# Altium project MiniPC.PrjPcb (part 16 of 17)

## Sheet 3V3_to_1V8.SchDoc: 3.3V to 1.8V Converter
size B; DocumentNumber: 45; SheetNumber: 45; SheetTotal: 46
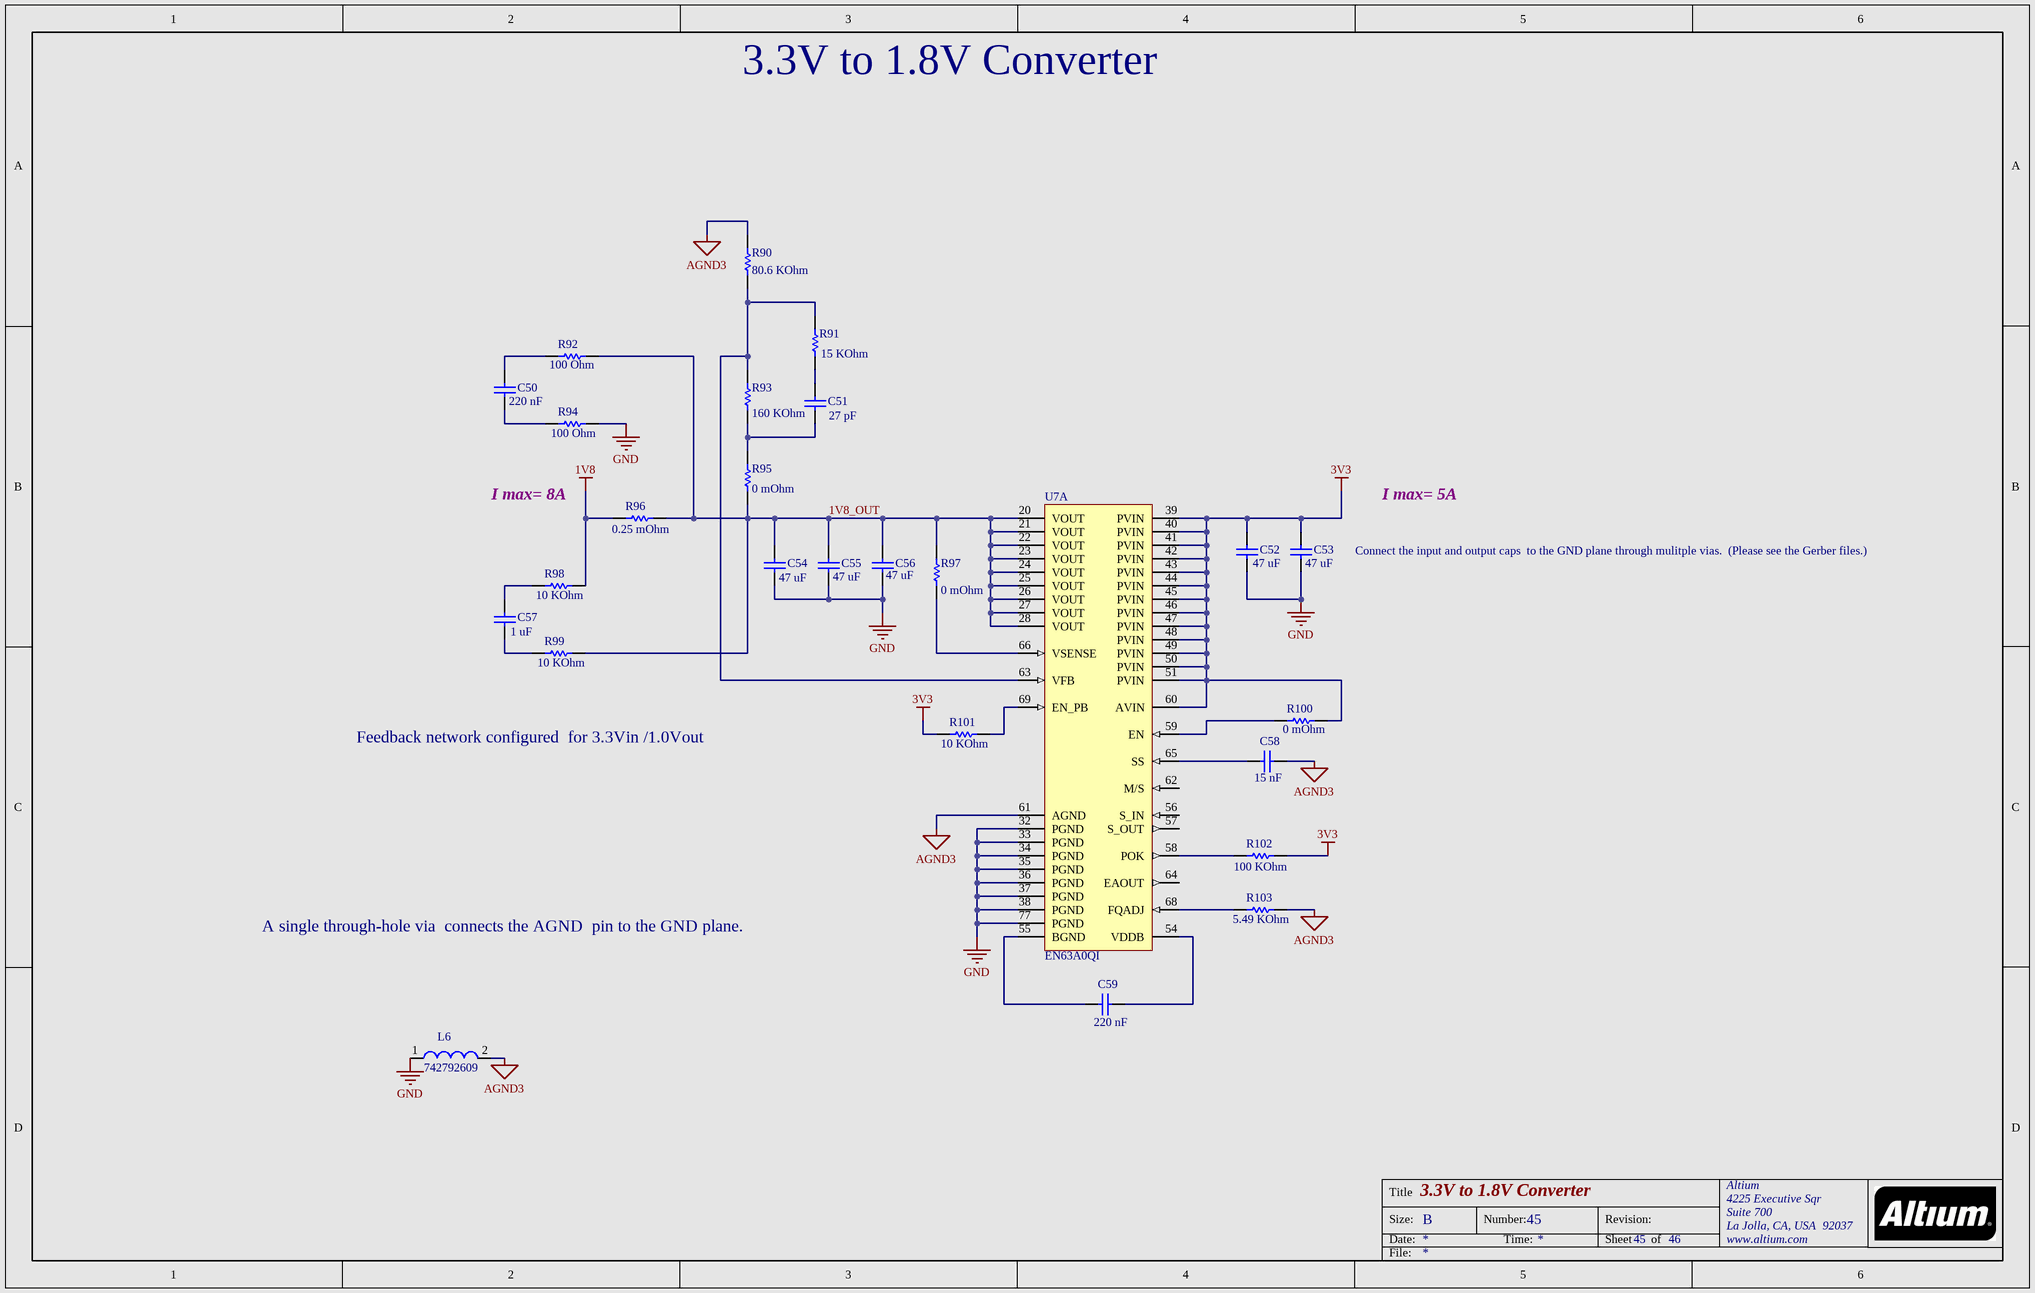
[diagram p48: 3V3_to_1V8.SchDoc]

### Parts
C50  Capacitance: 220 nF  [CAPC1005X55X25NL05T10]  (hidden comment: GRM155R61A224KE19D)
C51  Capacitance: 27 pF  [CAPC1005X55X20ML5T10]  (hidden comment: ECJ-0EC1H270J)
C52  Capacitance: 47 uF  [CAPC3216X180X20ML20]  (hidden comment: C3216X5R1A476M160AB)
C53  Capacitance: 47 uF  [CAPC3216X180X20ML20]  (hidden comment: C3216X5R1A476M160AB)
C54  Capacitance: 47 uF  [CAPC3216X180X20ML20]  (hidden comment: C3216X5R1A476M160AB)
C55  Capacitance: 47 uF  [CAPC3216X180X20ML20]  (hidden comment: C3216X5R1A476M160AB)
C56  Capacitance: 47 uF  [CAPC3216X180X20ML20]  (hidden comment: C3216X5R1A476M160AB)
C57  Capacitance: 1 uF  [CAPC1005X33X10LL5]  (hidden comment: CGB2A1X5R1E105K033BC)
C58  Capacitance: 15 nF  [CAPC1005X55X23ML05T8]  (hidden comment: VJ0402Y153JXQPW1BC)
C59  Capacitance: 220 nF  [CAPC1005X55X25NL05T10]  (hidden comment: GRM155R61A224KE19D)
L6  742792609  [SMD-0603]
R90  Resistance: 80.6 KOhm  [RESC1005X40X25ML05T05]  (hidden comment: ERJ-2RKF8062X)
R91  Resistance: 15 KOhm  [RESC1005X40X25ML05T05]  (hidden comment: ERJ-2RKF1502X)
R92  Resistance: 100 Ohm  [RESC1005X40X25LL05T05]  (hidden comment: ERJ-2RKF1000X)
R93  Resistance: 160 KOhm  [RESC1005X40X25ML05T05]  (hidden comment: CRCW0402160KFKED)
R94  Resistance: 100 Ohm  [RESC1005X40X25LL05T05]  (hidden comment: ERJ-2RKF1000X)
R95  Resistance: 0 mOhm  [RESC1005X40X25ML05T05]  (hidden comment: ERJ-2GE0R00X)
R96  Resistance: 0.25 mOhm  [STAC-CSS2725-099H_V]  (hidden comment: CSS2725FTL250)
R97  Resistance: 0 mOhm  [RESC1005X40X25ML05T05]  (hidden comment: ERJ-2GE0R00X)
R98  Resistance: 10 KOhm  [RESC1005X40X25NL05T05]  (hidden comment: ERJ-2RKF1002X)
R99  Resistance: 10 KOhm  [RESC1005X40X25NL05T05]  (hidden comment: ERJ-2RKF1002X)
R100  Resistance: 0 mOhm  [RESC1005X40X25ML05T05]  (hidden comment: ERJ-2GE0R00X)
R101  Resistance: 10 KOhm  [RESC1005X40X25NL05T05]  (hidden comment: ERJ-2RKF1002X)
R102  Resistance: 100 KOhm  [RESC1005X40X25LL05T05]  (hidden comment: ERJ-2RKF1003X)
R103  Resistance: 5.49 KOhm  [RESC1005X40X25NL05T05]  (hidden comment: ERJ-2RKF5491X)
U7  EN63A0QI  [ALTR-QFN-76_A-305_V]  (part A of 2)

### Nets
1V8: R96.1 R98.2
3V3: C52.2 C53.2 R100.1 R101.1 R102.2 U7.39(PVIN) U7.40(PVIN) U7.41(PVIN) U7.42(PVIN) U7.43(PVIN) U7.44(PVIN) U7.45(PVIN) U7.46(PVIN) U7.47(PVIN) U7.48(PVIN) U7.49(PVIN) U7.50(PVIN) U7.51(PVIN) U7.60(AVIN)
AGND3: C58.1 L6.2 R90.2 R103.2 U7.61(AGND)
GND: C52.1 C53.1 C54.1 C55.1 C56.1 L6.1 R94.1 U7.32(PGND) U7.33(PGND) U7.34(PGND) U7.35(PGND) U7.36(PGND) U7.37(PGND) U7.38(PGND) U7.77(PGND)
1V8_OUT: C54.2 C55.2 C56.2 R92.1 R95.1 R96.2 R97.2 R99.2 U7.20(VOUT) U7.21(VOUT) U7.22(VOUT) U7.23(VOUT) U7.24(VOUT) U7.25(VOUT) U7.26(VOUT) U7.27(VOUT) U7.28(VOUT)
NetC50_1: C50.1 R92.2
NetC50_2: C50.2 R94.2
NetC51_1: C51.1 R93.1 R95.2
NetC51_2: C51.2 R91.1
NetC57_1: C57.1 R99.1
NetC57_2: C57.2 R98.1
NetC58_2: C58.2 U7.65(SS)
NetC59_1: C59.1 U7.55(BGND)
NetC59_2: C59.2 U7.54(VDDB)
NetR90_1: R90.1 R91.2 R93.2 U7.63(VFB)
NetR97_1: R97.1 U7.66(VSENSE)
NetR100_2: R100.2 U7.59(EN)
NetR101_2: R101.2 U7.69(EN_PB)
NetR102_1: R102.1 U7.58(POK)
NetR103_1: R103.1 U7.68(FQADJ)

Not connected (* = marked no-connect by the designer): U7 56(S_IN) 57(S_OUT) 62(M/S) 64(EAOUT)

### Notes on the sheet
- I max= 8A
- I max= 5A
- Connect the input and output caps  to the GND plane through mulitple vias.  (Please see the Gerber files.)
- Feedback network configured  for 3.3Vin /1.0Vout
- A single through-hole via  connects the AGND  pin to the GND plane.
- Title
- Size:
- Date:
- B
- Number:
- Time:
- Revision:
- Sheet
- of
- File:

### Library data of the parts
C50 C59 = CMP-2008-04561-4: as C115 on sheet 12V_to_5V; ComponentLink1URL: http://www.murata.com/; Package Quantity: 1; Tolerance: 10%; Mounting Technology: Surface Mount; RoHSCompliant: true; PartNumber: GRM155R61A224KE19D; Max Operating Temperature: 85 degC; Case Code (Imperial): 0402; Length: 1 mm; Packaging: Tape and Reel; Min Operating Temperature: -55 degC; PackageDescription: 2-Pin Surface Mount Device, Body 1 x 0.5 mm; Height: 0.5 mm; Case Code (Metric): 1005; REACH SVHC: No SVHC; ComponentLink1Description: Manufacturer URL; Width: 0.5 mm; ComponentLink2URL: http://search.murata.co.jp/Ceramy/image/img/A01X/G101/ENG/GRM155R61A224KE19-01.pdf; Radiation Hardening: No; Pins: 2; Voltage Rating (DC): 10 V; DatasheetVersion: 03/2016; Mount: Surface Mount; PackageReference: 0402; ComponentLink2Description: Datasheet
C51 = CMP-1665-00021-1: as C17 on sheet 3.3V_to_1.0V; Tolerance: 5%; Min Operating Temperature: -55 degC; Max Operating Temperature: 125 degC; DatasheetVersion: 09/2008; Width: 0.02 inch; Packaging: Tape and Reel; RoHSCompliant: true; ComponentLink2URL: http://media.digikey.com/pdf/Data%20Sheets/Panasonic%20Capacitors%20PDFs/ECJ_(General).pdf; Mount: Surface Mount; ComponentLink1URL: http://www.panasonic.com/; PackageDescription: 2-Pin Surface Mount Device, Body 1 x 0.5 mm; Length: 0.039 inch; Case Code (Metric): 1005; Package Quantity: 10000; ComponentLink2Description: Datasheet; PackageReference: 0402; Height: 0.5 mm; Case Code (Imperial): 0402; Mounting Technology: Surface Mount; ComponentLink1Description: Manufacturer URL
C52-C56 = CMP-1663-00005-1: as C112 on sheet 12V_to_5V; Tolerance: 20%; Voltage Rating: 10 V; Packaging: Tape and Reel; ComponentLink2URL: https://product.tdk.com/info/en/catalog/datasheets/mlcc_commercial_general_en.pdf; Min Operating Temperature: -55 degC; Length: 3.2 mm; Radiation Hardening: No; Mounting Technology: Surface Mount; PackageDescription: 2-Pin Surface Mount Device, Body 3.2 x 1.6 mm; Max Operating Temperature: 85 degC; Case Code (Metric): 3216; ComponentLink1URL: http://www.tdk.com/; DatasheetVersion: 03/2015; Mount: Surface Mount; Case Code (Imperial): 1206; Package Quantity: 2000; ComponentLink2Description: Datasheet; PackageReference: 3216; Height: 1.6 mm; RoHSCompliant: true; Width: 1.6 mm; ComponentLink1Description: Manufacturer URL
C57 = CMP-1663-00006-2: as C109 on sheet 12V_to_5V; Tolerance: 10%; PackageDescription: 2-Pin Surface Mount Device, Body 1 x 0.5 mm; PartNumber: CGB2A1X5R1E105K033BC; Case Code (Metric): 1005; DatasheetVersion: 04/2015; RoHSCompliant: True; Max Operating Temperature: 85 degC; ComponentLink2URL: https://product.tdk.com/info/en/catalog/datasheets/mlcc_commercial_lowprofile_en.pdf; Package Quantity: 1; Width: 0.02 inch; Case/Package: 0402; Case Code (Imperial): 0402; Packaging: Tape and Reel; Length: 0.039 inch; Min Operating Temperature: -55 degC; Mounting Technology: Surface Mount; ComponentLink2Description: Datasheet; ComponentLink1URL: http://www.tdk.com/; ComponentLink1Description: Manufacturer URL
C58 = CMP-1666-00015-3: as C14 on sheet 3.3V_to_0.9V; DatasheetVersion: 07/2016; ComponentLink1Description: Manufacturer URL; ComponentLink1URL: http://www.vishay.com/; PackageDescription: 2-Pin Surface Mount Device, Body 1 x 0.5 mm; ComponentLink2URL: http://www.vishay.com/docs/28548/vjw1bcbascomseries.pdf; ComponentLink2Description: Datasheet; Mounting Technology: Surface Mount; Length: 1 mm; PartNumber: VJ0402Y153JXQPW1BC; RoHSCompliant: true; Package Quantity: 50000; Min Operating Temperature: -55 degC; Case Code (Metric): 1005; Max Operating Temperature: 125 degC; Width: 0.5 mm; Tolerance: 5%; Packaging: Tape and Reel; Case Code (Imperial): 0402; Height: 0.5 mm; PackageReference: 0402; Mount: Surface Mount; Pins: 2; Voltage Rating: 10 V
L6 = CMP-0220-00193-1: as L10 on sheet 12V_to_5V; ComponentLink2URL: http://www.we-online.de/katalog/media/pdf/742792609.pdf; ComponentLink1URL: http://www.we-online.com; ComponentLink2Description: Datasheet; PackageDescription: Chip Inductor, 2-Leads, Body 1.6 x 0.8 mm; ComponentLink1Description: Manufacturer Link; PackageReference: SMD-0603; DatasheetVersion: Dec-2005; PackageVersion: 2009
R90 = CMP-2002-01074-3: as R174 on sheet 12V_to_5V; REACH SVHC: No SVHC; Min Operating Temperature: -55 degC; Max Operating Temperature: 155 degC; ComponentLink1Description: Manufacturer URL; PackageDescription: 2-Pin Surface Mount Device, Body 1 x 0.5 mm; ComponentLink1URL: http://www.panasonic.com/; PartNumber: ERJ-2RKF8062X; Case Code (Metric): 1005; Packaging: Tape and Reel; Mount: Surface Mount; Tolerance: 1%; Package Quantity: 1; RoHSCompliant: true; Mounting Technology: Surface Mount; Height: 0.35 mm; Width: 0.5 mm; Case Code (Imperial): 0402; Length: 1 mm; ComponentLink2Description: Datasheet; Pins: 2; DatasheetVersion: 04/2015; ComponentLink2URL: http://industrial.panasonic.com/cdbs/www-data/pdf/RDA0000/AOA0000C86.pdf; PackageReference: 0402
R91 = CMP-2002-00694-3: as R22 on sheet 3.3V_to_0.9V; Max Operating Temperature: 155 degC; Case Code (Imperial): 0402; Case Code (Metric): 1005; PartNumber: ERJ-2RKF1502X; Package Quantity: 10000; REACH SVHC: Yes; Width: 0.5 mm; Mount: Surface Mount; Mounting Technology: Surface Mount; Packaging: Tape and Reel; Tolerance: 1%; ComponentLink1Description: Manufacturer URL; ComponentLink1URL: http://www.panasonic.com/; Height: 0.35 mm; Length: 1 mm; PackageDescription: 2-Pin Surface Mount Device, Body 1 x 0.5 mm; Min Operating Temperature: -55 degC; RoHSCompliant: true; Pins: 2; PackageReference: 0402; DatasheetVersion: 04/2015; ComponentLink2URL: http://industrial.panasonic.com/cdbs/www-data/pdf/RDA0000/AOA0000C86.pdf; Weight: 2.8E-05oz; Radiation Hardening: No; ComponentLink2Description: Datasheet
R92 R94 = CMP-2002-00605-3: as R28 on sheet 3.3V_to_0.9V; ComponentLink1URL: http://www.panasonic.com/; Package Quantity: 10000; Packaging: Tape and Reel; PackageDescription: 2-Pin Surface Mount Device, Body 1 x 0.5 mm; Tolerance: 1%; ComponentLink1Description: Manufacturer URL; REACH SVHC: Yes; Case Code (Imperial): 0402; Mounting Technology: Surface Mount; Min Operating Temperature: -55 degC; RoHSCompliant: true; Length: 1 mm; Width: 0.5 mm; Height: 0.35 mm; Max Operating Temperature: 155 degC; PartNumber: ERJ-2RKF1000X; Mount: Surface Mount; Case Code (Metric): 1005; Pins: 2; ComponentLink2Description: Datasheet; PackageReference: 0402; DatasheetVersion: 04/2015; Radiation Hardening: No; ComponentLink2URL: http://industrial.panasonic.com/cdbs/www-data/pdf/RDA0000/AOA0000C86.pdf
R93 = CMP-2002-08227-3: as R24 on sheet 3.3V_to_0.9V; Tolerance: 1%; Min Operating Temperature: -55 degC; Length: 1 mm; Height: 0.35 mm; Package Quantity: 10; Mounting Technology: Surface Mount; Mount: Surface Mount; Max Operating Temperature: 155 degC; PartNumber: CRCW0402160KFKED; Case Code (Imperial): 0402; Packaging: Tape and Reel; ComponentLink1Description: Manufacturer URL; Case Code (Metric): 1005; ComponentLink1URL: http://www.vishay.com/; RoHSCompliant: true; REACH SVHC: Unknown; PackageDescription: 2-Pin Surface Mount Device, Body 1 x 0.5 mm; Width: 0.5 mm; ComponentLink2Description: Datasheet; Pins: 2; PackageReference: 0402; Weight: 2.3E-05oz; ComponentLink2URL: http://www.vishay.com/docs/20035/dcrcwe3.pdf; Radiation Hardening: No; DatasheetVersion: 06/2012
R95 R97 R100 = CMP-2002-00429-3: as R173 on sheet 12V_to_5V; Max Operating Temperature: 155 degC; Tolerance: 5%; PartNumber: ERJ-2GE0R00X; Case Code (Imperial): 0402; Package Quantity: 10000; Length: 1 mm; Mounting Technology: Surface Mount; ComponentLink1URL: http://www.panasonic.com/; Height: 0.35 mm; Width: 0.5 mm; Min Operating Temperature: -55 degC; Case Code (Metric): 1005; RoHSCompliant: true; REACH SVHC: Unknown; ComponentLink1Description: Manufacturer URL; Packaging: Tape and Reel; Mount: Surface Mount; PackageDescription: 2-Pin Surface Mount Device, Body 1 x 0.5 mm; PackageReference: 0402; ComponentLink2URL: http://industrial.panasonic.com/cdbs/www-data/pdf/RDA0000/AOA0000C84.pdf; DatasheetVersion: 03/2015; Radiation Hardening: No; Pins: 2; ComponentLink2Description: Datasheet
R96 = CMP-1719-00001-2: as R42 on sheet 3.3V_to_1.0V; RoHSCompliant: True; ComponentLink2URL: https://www.seielect.com/catalog/SEI-CSS_CSSH.PDF; DatasheetVersion: 06/2016; Radiation Hardening: No; Packaging: Tape and Reel; Package Quantity: 1000; Max Operating Temperature: 225 degC; PackageDescription: 2-Pin Surface Mount Device, Body 6.81 x 6.45 mm; PartNumber: CSS2725FTL250; Length: 0.268 inch; Height: 0.049 inch; ComponentLink1Description: Manufacturer URL; Mounting Technology: Surface Mount; Width: 0.254 inch; ComponentLink2Description: Datasheet; ComponentLink1URL: https://www.seielect.com/; Min Operating Temperature: -55 degC; Tolerance: 1%
R98 R99 R101 = CMP-2002-00607-3: as R175 on sheet 12V_to_5V; Case Code (Imperial): 0402; Min Operating Temperature: -55 degC; PartNumber: ERJ-2RKF1002X; Mounting Technology: Surface Mount; Length: 1 mm; Packaging: Tape and Reel; ComponentLink1Description: Manufacturer URL; Mount: Surface Mount; Package Quantity: 10000; Max Operating Temperature: 155 degC; Case Code (Metric): 1005; Height: 0.35 mm; ComponentLink1URL: http://www.panasonic.com/; Tolerance: 1%; REACH SVHC: Yes; RoHSCompliant: true; Width: 0.5 mm; PackageDescription: 2-Pin Surface Mount Device, Body 1 x 0.5 mm; Radiation Hardening: No; PackageReference: 0402; ComponentLink2Description: Datasheet; DatasheetVersion: 04/2015; ComponentLink2URL: http://industrial.panasonic.com/cdbs/www-data/pdf/RDA0000/AOA0000C86.pdf; Pins: 2
R102 = CMP-2002-00608-3: as R176 on sheet 12V_to_5V; Height: 0.35 mm; ComponentLink1Description: Manufacturer URL; Packaging: Tape and Reel; Min Operating Temperature: -55 degC; RoHSCompliant: true; PackageDescription: 2-Pin Surface Mount Device, Body 1 x 0.5 mm; Mount: Surface Mount; Package Quantity: 10000; Max Operating Temperature: 155 degC; ComponentLink1URL: http://www.panasonic.com/; Tolerance: 1%; Mounting Technology: Surface Mount; PartNumber: ERJ-2RKF1003X; Case Code (Metric): 1005; Case Code (Imperial): 0402; REACH SVHC: Yes; Length: 1 mm; Width: 0.5 mm; DatasheetVersion: 04/2015; Pins: 2; ComponentLink2Description: Datasheet; ComponentLink2URL: http://industrial.panasonic.com/cdbs/www-data/pdf/RDA0000/AOA0000C86.pdf; PackageReference: 0402; Radiation Hardening: No
R103 = CMP-2002-00990-3: as R62 on sheet 3.3V_to_DDR4_VDD; Tolerance: 1%; Packaging: Tape and Reel; RoHSCompliant: true; Length: 0.039 inch; PackageDescription: 2-Pin Surface Mount Device, Body 1 x 0.5 mm; Height: 0.016 inch; Case Code (Imperial): 0402; Min Operating Temperature: -55 degC; PartNumber: ERJ-2RKF5491X; Case Code (Metric): 1005; ComponentLink1Description: Manufacturer URL; Width: 0.02 inch; Package Quantity: 10000; ComponentLink1URL: http://www.panasonic.com/; Mount: Surface Mount; Mounting Technology: Surface Mount; REACH SVHC: Yes; Max Operating Temperature: 155 degC; ComponentLink2URL: http://industrial.panasonic.com/cdbs/www-data/pdf/RDA0000/AOA0000C86.pdf; Pins: 2; ComponentLink2Description: Datasheet; PackageReference: 0402; DatasheetVersion: 04/2015
U7 = CMP-1689-00005-3: as U3 on sheet 3.3V_to_1.0V; PartNumber: EN63A0QI; PackageVersion: Rev. A, 10/2014; ComponentLink3Description: Package Specification; ComponentLink3URL: http://wl.altera.com/literature/ds/EN63A0QA_10398.pdf; PackageDescription: 76-Pin Quad-Flat No-Leads Package, Body 11 x 10 mm, Pitch 0.5 mm, Thermal Pad 2.6x8.1mm; ComponentLink1URL: https://www.altera.com/; DatasheetVersion: Rev. H; Mounting Technology: Surface Mount; ComponentLink2Description: Datasheet; ComponentLink1Description: Manufacturer URL; ComponentLink2URL: https://www.altera.com/content/dam/altera-www/global/en_US/pdfs/literature/ds/en63a0qi_07077.pdf; Pins: 76; Min Operating Temperature: -40 degC; Length: 0.43 inch; Radiation Hardening: No; Max Operating Temperature: 85 degC; Package Quantity: 250; Width: 0.39 inch; Mount: Surface Mount; Packaging: Tape and Reel; Height: 0.12 inch; RoHSCompliant: True

## Sheet 2.5V_and_1.8V_Switches.SchDoc: 2.5V and 1.8V IO Switches
size B; DocumentNumber: 38; SheetNumber: 38; SheetTotal: 46
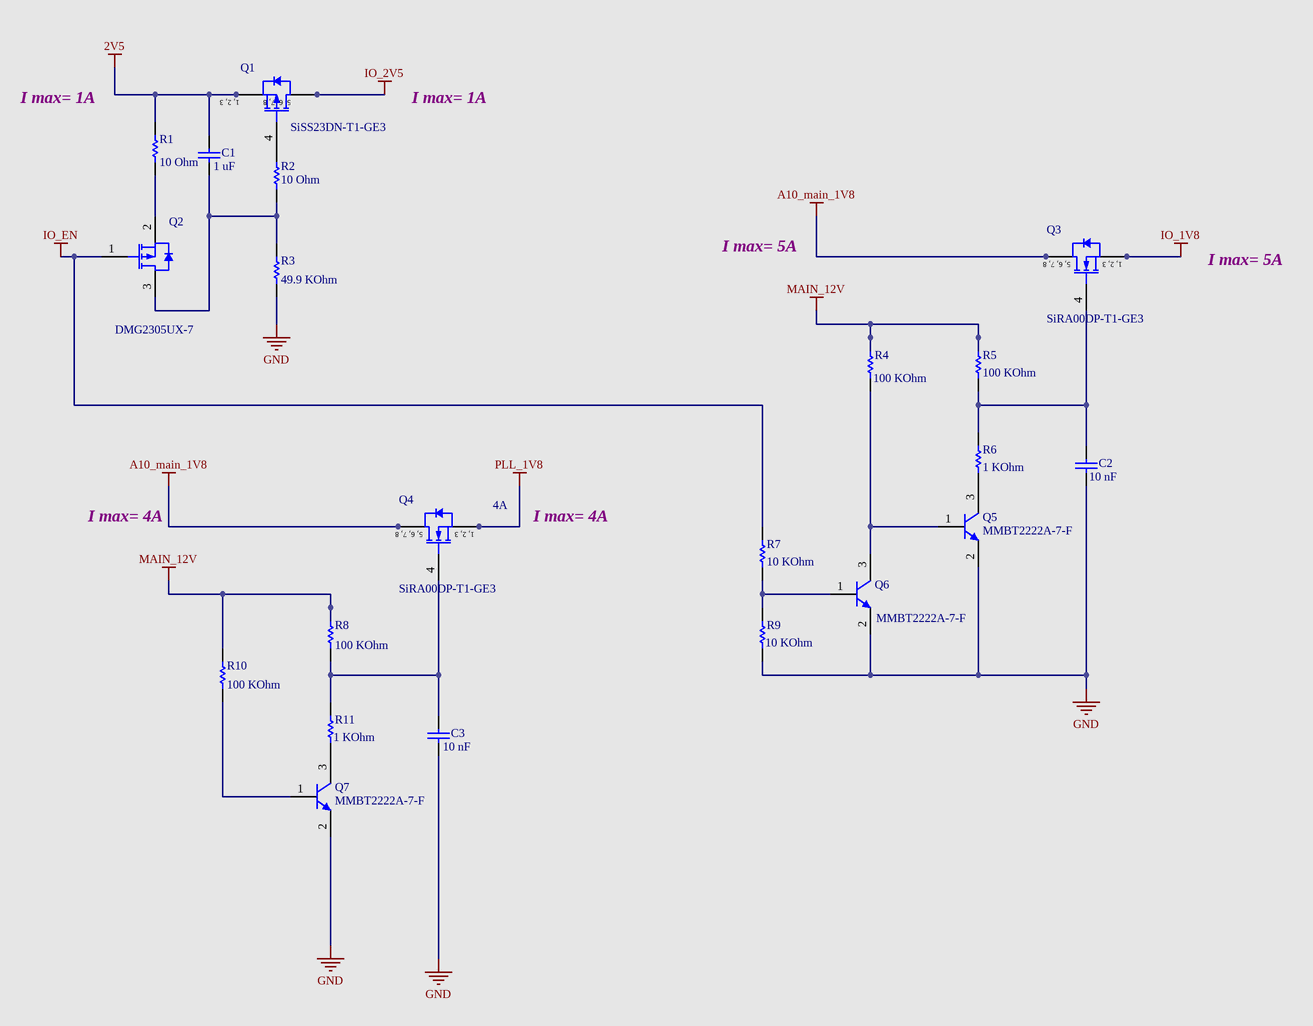
[diagram p49: 2.5V_and_1.8V_Switches.SchDoc]

### Parts
C1  Capacitance: 1 uF  [CAPC1005X33X10LL5]  (hidden comment: CGB2A1X5R1E105K033BC)
C2  Capacitance: 10 nF  [CAPC1005X55X25ML05T10]  (hidden comment: GRM155R71H103KA88D)
C3  Capacitance: 10 nF  [CAPC1005X55X25ML05T10]  (hidden comment: GRM155R71H103KA88D)
Q1  SiSS23DN-T1-GE3  [VISH-PPAK1212-8S_V]
Q2  DMG2305UX-7  [DIOD-SOT23-3_A_V]
Q3  SiRA00DP-T1-GE3  [VISH-PPAKSO-8_V]
Q4  SiRA00DP-T1-GE3  [VISH-PPAKSO-8_V]
Q5  MMBT2222A-7-F  [DIOD-SOT23-3_V]
Q6  MMBT2222A-7-F  [DIOD-SOT23-3_V]
Q7  MMBT2222A-7-F  [DIOD-SOT23-3_V]
R1  Resistance: 10 Ohm  [RESC1005X40X25LL05T05]  (hidden comment: ERJ-2RKF10R0X)
R2  Resistance: 10 Ohm  [RESC1005X40X25LL05T05]  (hidden comment: ERJ-2RKF10R0X)
R3  Resistance: 49.9 KOhm  [RESC1005X40X25LL05T05]  (hidden comment: ERJ-2RKF4992X)
R4  Resistance: 100 KOhm  [RESC1005X40X25LL05T05]  (hidden comment: ERJ-2RKF1003X)
R5  Resistance: 100 KOhm  [RESC1005X40X25LL05T05]  (hidden comment: ERJ-2RKF1003X)
R6  Resistance: 1 KOhm  [RESC1005X40X25LL05T05]  (hidden comment: ERJ-2RKF1001X)
R7  Resistance: 10 KOhm  [RESC1005X40X25NL05T05]  (hidden comment: ERJ-2RKF1002X)
R8  Resistance: 100 KOhm  [RESC1005X40X25LL05T05]  (hidden comment: ERJ-2RKF1003X)
R9  Resistance: 10 KOhm  [RESC1005X40X25NL05T05]  (hidden comment: ERJ-2RKF1002X)
R10  Resistance: 100 KOhm  [RESC1005X40X25LL05T05]  (hidden comment: ERJ-2RKF1003X)
R11  Resistance: 1 KOhm  [RESC1005X40X25LL05T05]  (hidden comment: ERJ-2RKF1001X)

### Nets
2V5: C1.2 Q1.1(S) Q1.2(S) Q1.3(S) R1.2
A10_main_1V8: Q3.5(D) Q3.6(D) Q3.7(D) Q3.8(D) Q4.5(D) Q4.6(D) Q4.7(D) Q4.8(D)
GND: C2.1 C3.1 Q5.2(E) Q6.2(E) Q7.2(E) R3.1 R9.1
IO_1V8: Q3.1(S) Q3.2(S) Q3.3(S)
IO_2V5: Q1.5(D) Q1.6(D) Q1.7(D) Q1.8(D)
IO_EN: Q2.1(GATE) R7.2
MAIN_12V: R4.2 R5.2 R8.2 R10.2
PLL_1V8: Q4.1(S) Q4.2(S) Q4.3(S)
NetC1_1: C1.1 Q2.3(DRAIN) R2.1 R3.2
NetC2_2: C2.2 Q3.4(G) R5.1 R6.2
NetC3_2: C3.2 Q4.4(G) R8.1 R11.2
NetQ1_4: Q1.4(G) R2.2
NetQ2_2: Q2.2(SOURCE) R1.1
NetQ5_1: Q5.1(B) Q6.3(C) R4.1
NetQ5_3: Q5.3(C) R6.1
NetQ6_1: Q6.1(B) R7.1 R9.2
NetQ7_1: Q7.1(B) R10.1
NetQ7_3: Q7.3(C) R11.1

### Notes on the sheet
- I max= 1A
- I max= 5A
- I max= 4A
- (near Q4) 4A
- Title
- Size:
- Date:
- B
- Number:
- Time:
- Revision:
- Sheet
- of
- File:
- (in symbol CMP-1709-00001-3) 1, 2, 3; 5, 6, 7, 8
- (in symbol CMP-1709-00004-3) 5, 6, 7, 8; 1, 2, 3

### Library data of the parts
C1 = CMP-1663-00006-2: as C109 on sheet 12V_to_5V; Tolerance: 10%; PackageDescription: 2-Pin Surface Mount Device, Body 1 x 0.5 mm; PartNumber: CGB2A1X5R1E105K033BC; Case Code (Metric): 1005; DatasheetVersion: 04/2015; RoHSCompliant: True; Max Operating Temperature: 85 degC; ComponentLink2URL: https://product.tdk.com/info/en/catalog/datasheets/mlcc_commercial_lowprofile_en.pdf; Package Quantity: 1; Width: 0.02 inch; Case/Package: 0402; Case Code (Imperial): 0402; Packaging: Tape and Reel; Length: 0.039 inch; Min Operating Temperature: -55 degC; Mounting Technology: Surface Mount; ComponentLink2Description: Datasheet; ComponentLink1URL: http://www.tdk.com/; ComponentLink1Description: Manufacturer URL
C2 C3 = CMP-2008-04637-4: Chip Capacitor, 10 nF, +/- 10%, 50 V, -55 to 125 degC, 0402 (1005 Metric), RoHS, Tape and Reel; Manufacturer: Basic Passives; Voltage Rating: 50 V; Case\/Package: 0402; Type (Capacitors): X7R; Mounting Technology: Surface Mount; Max Operating Temperature: 125 degC; Height: 0.5 mm; PackageDescription: 2-Pin Surface Mount Device, Body 1 x 0.5 mm; Case Code (Imperial): 0402; Tolerance: 10%; ComponentLink1URL: http://www.murata.com/; RoHSCompliant: true; Width: 0.5 mm; Package Quantity: 10000; Packaging: Tape and Reel; ComponentLink1Description: Manufacturer URL; Min Operating Temperature: -55 degC; PartNumber: GRM155R71H103KA88D; REACH SVHC: No SVHC; Case Code (Metric): 1005; Length: 1 mm; DatasheetVersion: 02/2016; Mount: Surface Mount; Radiation Hardening: No; Lead Pitch: 2mm; Voltage Rating (DC): 50 V; Pins: 2; ComponentLink2URL: http://search.murata.co.jp/Ceramy/image/img/A01X/G101/ENG/GRM155R71H103KA88-01.pdf; ComponentLink2Description: Datasheet; PackageReference: 0402
Q1 = CMP-1709-00001-3: P-Channel MOSFET, 20 V, -50 to 150 degC, 8-Pin SMD (PPAK1212-8S), RoHS, Tape and Reel; ComponentLink1URL: http://www.vishay.com/; PackageVersion: Rev. A, 03/2012; PackageDescription: 8-Pin Surface Mount Device, Body 3.3 x 3.3 mm, Pitch 0.66 mm; ComponentLink3Description: Package Specification; ComponentLink2Description: Datasheet; ComponentLink2URL: http://www.vishay.com/docs/62852/siss23dn.pdf; ComponentLink1Description: Manufacturer URL; DatasheetVersion: Rev. A; ComponentLink3URL: http://www.vishay.com/docs/63919/caseoutl.pdf; Mounting Technology: Surface Mount; PartNumber: SiSS23DN-T1-GE3
Q2 = CMP-1693-00002-1: P-Channel Enhancement Mode MOSFET, 20 V, -55 to 150 degC, 3-Pin SOT23, RoHS, Tape and Reel; Manufacturer: Diodes Inc; PackageReference: SOT23-3; PartNumber: DMG2305UX-7; PackageDescription: 3-Pin Small Outline Transistor, Body 2.9 x 1.3 mm, Pitch 0.915 mm; ComponentLink1Description: Manufacturer URL; Mounting Technology: Surface Mount; DatasheetVersion: Rev. 5-2; ComponentLink1URL: http://www.diodes.com/; ComponentLink2URL: http://www.diodes.com/_files/datasheets/DMG2305UX.pdf; ComponentLink2Description: Datasheet
Q3 Q4 = CMP-1709-00004-3: N-Channe MOSFET, 30 V, -55 to 150 degC, 8-Pin SMD (PPAKSO-8), RoHS, Tape and Reel; PartNumber: SiRA00DP-T1-GE3; ComponentLink1Description: Manufacturer URL; ComponentLink1URL: http://www.vishay.com/; ComponentLink2URL: http://www.vishay.com/docs/63780/sira00dp.pdf; DatasheetVersion: Rev. B; Mounting Technology: Surface Mount; ComponentLink2Description: Datasheet; PackageDescription: 8-Pin Surface Mount Device, Body 4.9 x 5.89 mm, Pitch 1.27 mm; Width: 5 mm; Mount: Surface Mount; Packaging: Tape and Reel; RoHSCompliant: True; Radiation Hardening: No; Min Operating Temperature: -55 degC; REACH SVHC: Unknown; Max Operating Temperature: 150 degC; Case/Package: SOIC; Package Quantity: 1; Length: 5.99 mm; Height: 1.07 mm; Pins: 8
Q5-Q7 = CMP-1693-00003-1: NPN Small Signal Transistor, 40 V, -55 to 150 degC, 3-Pin SOT23, RoHS, Tape and Reel; Manufacturer: Diodes Inc; ComponentLink1URL: http://www.diodes.com/; ComponentLink2Description: Datasheet; PackageReference: SOT23-3; PartNumber: MMBT2222A-7-F; ComponentLink1Description: Manufacturer URL; ComponentLink2URL: http://www.diodes.com/_files/datasheets/ds30041.pdf; PackageDescription: 3-Pin Small Outline Transistor, Body 2.9 x 1.3 mm, Pitch 0.95 mm; DatasheetVersion: Rev. 16 - 2; Mounting Technology: Surface Mount
R1 R2 = CMP-2002-00622-3: Chip Resistor, 10 Ohm, +/- 1%, 100 mW, -55 to 155 degC, 0402 (1005 Metric), RoHS, Tape and Reel; Manufacturer: Basic Passives; Voltage Rating: 50 V; Power Rating: 100 mW; Case\/Package: 0402; RoHSCompliant: true; PartNumber: ERJ-2RKF10R0X; Case Code (Imperial): 0402; Package Quantity: 10000; ComponentLink1Description: Manufacturer URL; Width: 0.5 mm; Height: 0.35 mm; Tolerance: 1%; REACH SVHC: Yes; Case Code (Metric): 1005; Max Operating Temperature: 155 degC; PackageDescription: 2-Pin Surface Mount Device, Body 1 x 0.5 mm; Mounting Technology: Surface Mount; Min Operating Temperature: -55 degC; Mount: Surface Mount; Packaging: Tape and Reel; ComponentLink1URL: http://www.panasonic.com/; Length: 1 mm; ComponentLink2Description: Datasheet; Pins: 2; PackageReference: 0402; Radiation Hardening: No; ComponentLink2URL: http://industrial.panasonic.com/cdbs/www-data/pdf/RDA0000/AOA0000C86.pdf; DatasheetVersion: 04/2015
R3 = CMP-2002-00967-3: as R179 on sheet 12V_to_5V; Case Code (Metric): 1005; Case Code (Imperial): 0402; Min Operating Temperature: -55 degC; Length: 1 mm; Height: 0.35 mm; ComponentLink1URL: http://www.panasonic.com/; PackageDescription: 2-Pin Surface Mount Device, Body 1 x 0.5 mm; PartNumber: ERJ-2RKF4992X; RoHSCompliant: true; Tolerance: 1%; Width: 0.5 mm; ComponentLink1Description: Manufacturer URL; Package Quantity: 10000; Packaging: Tape and Reel; REACH SVHC: No SVHC; Mount: Surface Mount; Mounting Technology: Surface Mount; Max Operating Temperature: 155 degC; Pins: 2; DatasheetVersion: 04/2015; ComponentLink2URL: http://industrial.panasonic.com/cdbs/www-data/pdf/RDA0000/AOA0000C86.pdf; Radiation Hardening: No; PackageReference: 0402; ComponentLink2Description: Datasheet
R4 R5 R8 R10 = CMP-2002-00608-3: as R176 on sheet 12V_to_5V; Height: 0.35 mm; ComponentLink1Description: Manufacturer URL; Packaging: Tape and Reel; Min Operating Temperature: -55 degC; RoHSCompliant: true; PackageDescription: 2-Pin Surface Mount Device, Body 1 x 0.5 mm; Mount: Surface Mount; Package Quantity: 10000; Max Operating Temperature: 155 degC; ComponentLink1URL: http://www.panasonic.com/; Tolerance: 1%; Mounting Technology: Surface Mount; PartNumber: ERJ-2RKF1003X; Case Code (Metric): 1005; Case Code (Imperial): 0402; REACH SVHC: Yes; Length: 1 mm; Width: 0.5 mm; DatasheetVersion: 04/2015; Pins: 2; ComponentLink2Description: Datasheet; ComponentLink2URL: http://industrial.panasonic.com/cdbs/www-data/pdf/RDA0000/AOA0000C86.pdf; PackageReference: 0402; Radiation Hardening: No
R6 R11 = CMP-2002-00606-3: Chip Resistor, 1 KOhm, +/- 1%, 100 mW, -55 to 155 degC, 0402 (1005 Metric), RoHS, Tape and Reel; Manufacturer: Basic Passives; Voltage Rating: 50 V; Power Rating: 100 mW; Case\/Package: 0402; PartNumber: ERJ-2RKF1001X; Width: 0.5 mm; ComponentLink1URL: http://www.panasonic.com/; Length: 1 mm; Min Operating Temperature: -55 degC; PackageDescription: 2-Pin Surface Mount Device, Body 1 x 0.5 mm; Case Code (Metric): 1005; Height: 0.35 mm; ComponentLink1Description: Manufacturer URL; Mounting Technology: Surface Mount; Tolerance: 1%; Packaging: Tape and Reel; Package Quantity: 10000; REACH SVHC: Yes; Max Operating Temperature: 155 degC; Mount: Surface Mount; RoHSCompliant: true; Case Code (Imperial): 0402; DatasheetVersion: 04/2015; Radiation Hardening: No; Pins: 2; ComponentLink2Description: Datasheet; PackageReference: 0402; ComponentLink2URL: http://industrial.panasonic.com/cdbs/www-data/pdf/RDA0000/AOA0000C86.pdf
R7 R9 = CMP-2002-00607-3: as R175 on sheet 12V_to_5V; Case Code (Imperial): 0402; Min Operating Temperature: -55 degC; PartNumber: ERJ-2RKF1002X; Mounting Technology: Surface Mount; Length: 1 mm; Packaging: Tape and Reel; ComponentLink1Description: Manufacturer URL; Mount: Surface Mount; Package Quantity: 10000; Max Operating Temperature: 155 degC; Case Code (Metric): 1005; Height: 0.35 mm; ComponentLink1URL: http://www.panasonic.com/; Tolerance: 1%; REACH SVHC: Yes; RoHSCompliant: true; Width: 0.5 mm; PackageDescription: 2-Pin Surface Mount Device, Body 1 x 0.5 mm; Radiation Hardening: No; PackageReference: 0402; ComponentLink2Description: Datasheet; DatasheetVersion: 04/2015; ComponentLink2URL: http://industrial.panasonic.com/cdbs/www-data/pdf/RDA0000/AOA0000C86.pdf; Pins: 2

## Sheet 3.3V_and_1.8V_Load.SchDoc: 3.3V and 1.8V Discharge Load
size B; DocumentNumber: 39; SheetNumber: 39; SheetTotal: 46
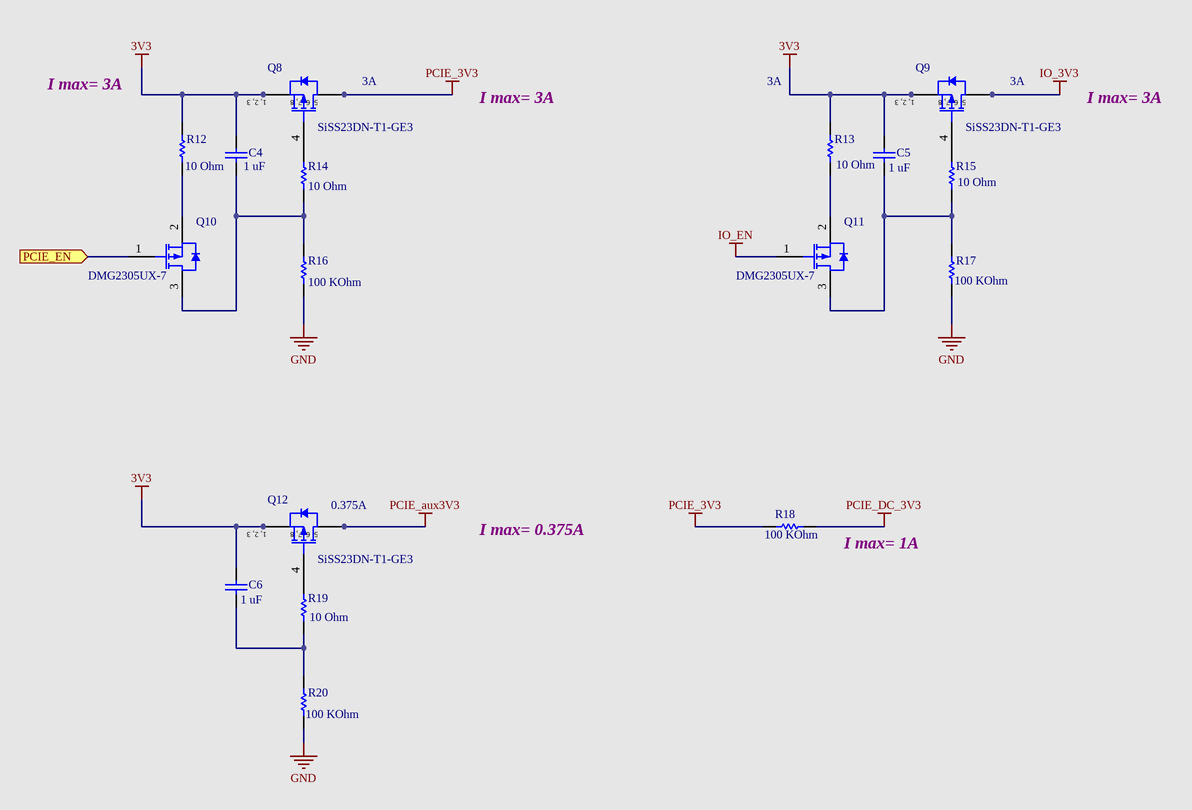
[diagram p50: 3.3V_and_1.8V_Load.SchDoc]

### Parts
C4  Capacitance: 1 uF  [CAPC1005X33X10LL5]  (hidden comment: CGB2A1X5R1E105K033BC)
C5  Capacitance: 1 uF  [CAPC1005X33X10LL5]  (hidden comment: CGB2A1X5R1E105K033BC)
C6  Capacitance: 1 uF  [CAPC1005X33X10LL5]  (hidden comment: CGB2A1X5R1E105K033BC)
Q8  SiSS23DN-T1-GE3  [VISH-PPAK1212-8S_V]
Q9  SiSS23DN-T1-GE3  [VISH-PPAK1212-8S_V]
Q10  DMG2305UX-7  [DIOD-SOT23-3_A_V]
Q11  DMG2305UX-7  [DIOD-SOT23-3_A_V]
Q12  SiSS23DN-T1-GE3  [VISH-PPAK1212-8S_V]
R12  Resistance: 10 Ohm  [RESC1005X40X25LL05T05]  (hidden comment: ERJ-2RKF10R0X)
R13  Resistance: 10 Ohm  [RESC1005X40X25LL05T05]  (hidden comment: ERJ-2RKF10R0X)
R14  Resistance: 10 Ohm  [RESC1005X40X25LL05T05]  (hidden comment: ERJ-2RKF10R0X)
R15  Resistance: 10 Ohm  [RESC1005X40X25LL05T05]  (hidden comment: ERJ-2RKF10R0X)
R16  Resistance: 100 KOhm  [RESC1005X40X25LL05T05]  (hidden comment: ERJ-2RKF1003X)
R17  Resistance: 100 KOhm  [RESC1005X40X25LL05T05]  (hidden comment: ERJ-2RKF1003X)
R18  Resistance: 100 KOhm  [RESC1005X40X25LL05T05]  (hidden comment: ERJ-2RKF1003X)
R19  Resistance: 10 Ohm  [RESC1005X40X25LL05T05]  (hidden comment: ERJ-2RKF10R0X)
R20  Resistance: 100 KOhm  [RESC1005X40X25LL05T05]  (hidden comment: ERJ-2RKF1003X)

### Ports
PCIE_EN (in)

### Nets
3V3: C4.2 C5.2 C6.2 Q8.1(S) Q8.2(S) Q8.3(S) Q9.1(S) Q9.2(S) Q9.3(S) Q12.1(S) Q12.2(S) Q12.3(S) R12.2 R13.2
GND: R16.1 R17.1 R20.1
IO_3V3: Q9.5(D) Q9.6(D) Q9.7(D) Q9.8(D)
IO_EN: Q11.1(GATE)
PCIE_3V3: Q8.5(D) Q8.6(D) Q8.7(D) Q8.8(D) R18.2
PCIE_aux3V3: Q12.5(D) Q12.6(D) Q12.7(D) Q12.8(D)
PCIE_DC_3V3: R18.1
PCIE_EN: Q10.1(GATE) ; port PCIE_EN
NetC4_1: C4.1 Q10.3(DRAIN) R14.1 R16.2
NetC5_1: C5.1 Q11.3(DRAIN) R15.1 R17.2
NetC6_1: C6.1 R19.1 R20.2
NetQ8_4: Q8.4(G) R14.2
NetQ9_4: Q9.4(G) R15.2
NetQ10_2: Q10.2(SOURCE) R12.1
NetQ11_2: Q11.2(SOURCE) R13.1
NetQ12_4: Q12.4(G) R19.2

### Notes on the sheet
- I max= 3A
- (near Q8) 3A
- 3A
- (near Q9) 3A
- (near Q12) 0.375A
- I max= 0.375A
- (near R18) I max= 1A
- Title
- Size:
- Date:
- B
- Number:
- Time:
- Revision:
- Sheet
- of
- File:
- (in symbol CMP-1709-00001-3) 1, 2, 3; 5, 6, 7, 8

### Library data of the parts
C4-C6 = CMP-1663-00006-2: as C109 on sheet 12V_to_5V; Tolerance: 10%; PackageDescription: 2-Pin Surface Mount Device, Body 1 x 0.5 mm; PartNumber: CGB2A1X5R1E105K033BC; Case Code (Metric): 1005; DatasheetVersion: 04/2015; RoHSCompliant: True; Max Operating Temperature: 85 degC; ComponentLink2URL: https://product.tdk.com/info/en/catalog/datasheets/mlcc_commercial_lowprofile_en.pdf; Package Quantity: 1; Width: 0.02 inch; Case/Package: 0402; Case Code (Imperial): 0402; Packaging: Tape and Reel; Length: 0.039 inch; Min Operating Temperature: -55 degC; Mounting Technology: Surface Mount; ComponentLink2Description: Datasheet; ComponentLink1URL: http://www.tdk.com/; ComponentLink1Description: Manufacturer URL
Q8 Q9 Q12 = CMP-1709-00001-3: as Q1 on sheet 2.5V_and_1.8V_Switches; ComponentLink1URL: http://www.vishay.com/; PackageVersion: Rev. A, 03/2012; PackageDescription: 8-Pin Surface Mount Device, Body 3.3 x 3.3 mm, Pitch 0.66 mm; ComponentLink3Description: Package Specification; ComponentLink2Description: Datasheet; ComponentLink2URL: http://www.vishay.com/docs/62852/siss23dn.pdf; ComponentLink1Description: Manufacturer URL; DatasheetVersion: Rev. A; ComponentLink3URL: http://www.vishay.com/docs/63919/caseoutl.pdf; Mounting Technology: Surface Mount; PartNumber: SiSS23DN-T1-GE3
Q10 Q11 = CMP-1693-00002-1: as Q2 on sheet 2.5V_and_1.8V_Switches; PackageReference: SOT23-3; PartNumber: DMG2305UX-7; PackageDescription: 3-Pin Small Outline Transistor, Body 2.9 x 1.3 mm, Pitch 0.915 mm; ComponentLink1Description: Manufacturer URL; Mounting Technology: Surface Mount; DatasheetVersion: Rev. 5-2; ComponentLink1URL: http://www.diodes.com/; ComponentLink2URL: http://www.diodes.com/_files/datasheets/DMG2305UX.pdf; ComponentLink2Description: Datasheet
R12-R15 R19 = CMP-2002-00622-3: as R1 on sheet 2.5V_and_1.8V_Switches; RoHSCompliant: true; PartNumber: ERJ-2RKF10R0X; Case Code (Imperial): 0402; Package Quantity: 10000; ComponentLink1Description: Manufacturer URL; Width: 0.5 mm; Height: 0.35 mm; Tolerance: 1%; REACH SVHC: Yes; Case Code (Metric): 1005; Max Operating Temperature: 155 degC; PackageDescription: 2-Pin Surface Mount Device, Body 1 x 0.5 mm; Mounting Technology: Surface Mount; Min Operating Temperature: -55 degC; Mount: Surface Mount; Packaging: Tape and Reel; ComponentLink1URL: http://www.panasonic.com/; Length: 1 mm; ComponentLink2Description: Datasheet; Pins: 2; PackageReference: 0402; Radiation Hardening: No; ComponentLink2URL: http://industrial.panasonic.com/cdbs/www-data/pdf/RDA0000/AOA0000C86.pdf; DatasheetVersion: 04/2015
R16-R18 R20 = CMP-2002-00608-3: as R176 on sheet 12V_to_5V; Height: 0.35 mm; ComponentLink1Description: Manufacturer URL; Packaging: Tape and Reel; Min Operating Temperature: -55 degC; RoHSCompliant: true; PackageDescription: 2-Pin Surface Mount Device, Body 1 x 0.5 mm; Mount: Surface Mount; Package Quantity: 10000; Max Operating Temperature: 155 degC; ComponentLink1URL: http://www.panasonic.com/; Tolerance: 1%; Mounting Technology: Surface Mount; PartNumber: ERJ-2RKF1003X; Case Code (Metric): 1005; Case Code (Imperial): 0402; REACH SVHC: Yes; Length: 1 mm; Width: 0.5 mm; DatasheetVersion: 04/2015; Pins: 2; ComponentLink2Description: Datasheet; ComponentLink2URL: http://industrial.panasonic.com/cdbs/www-data/pdf/RDA0000/AOA0000C86.pdf; PackageReference: 0402; Radiation Hardening: No